# Altium schematic sheet KLogShield.SchDoc
size C
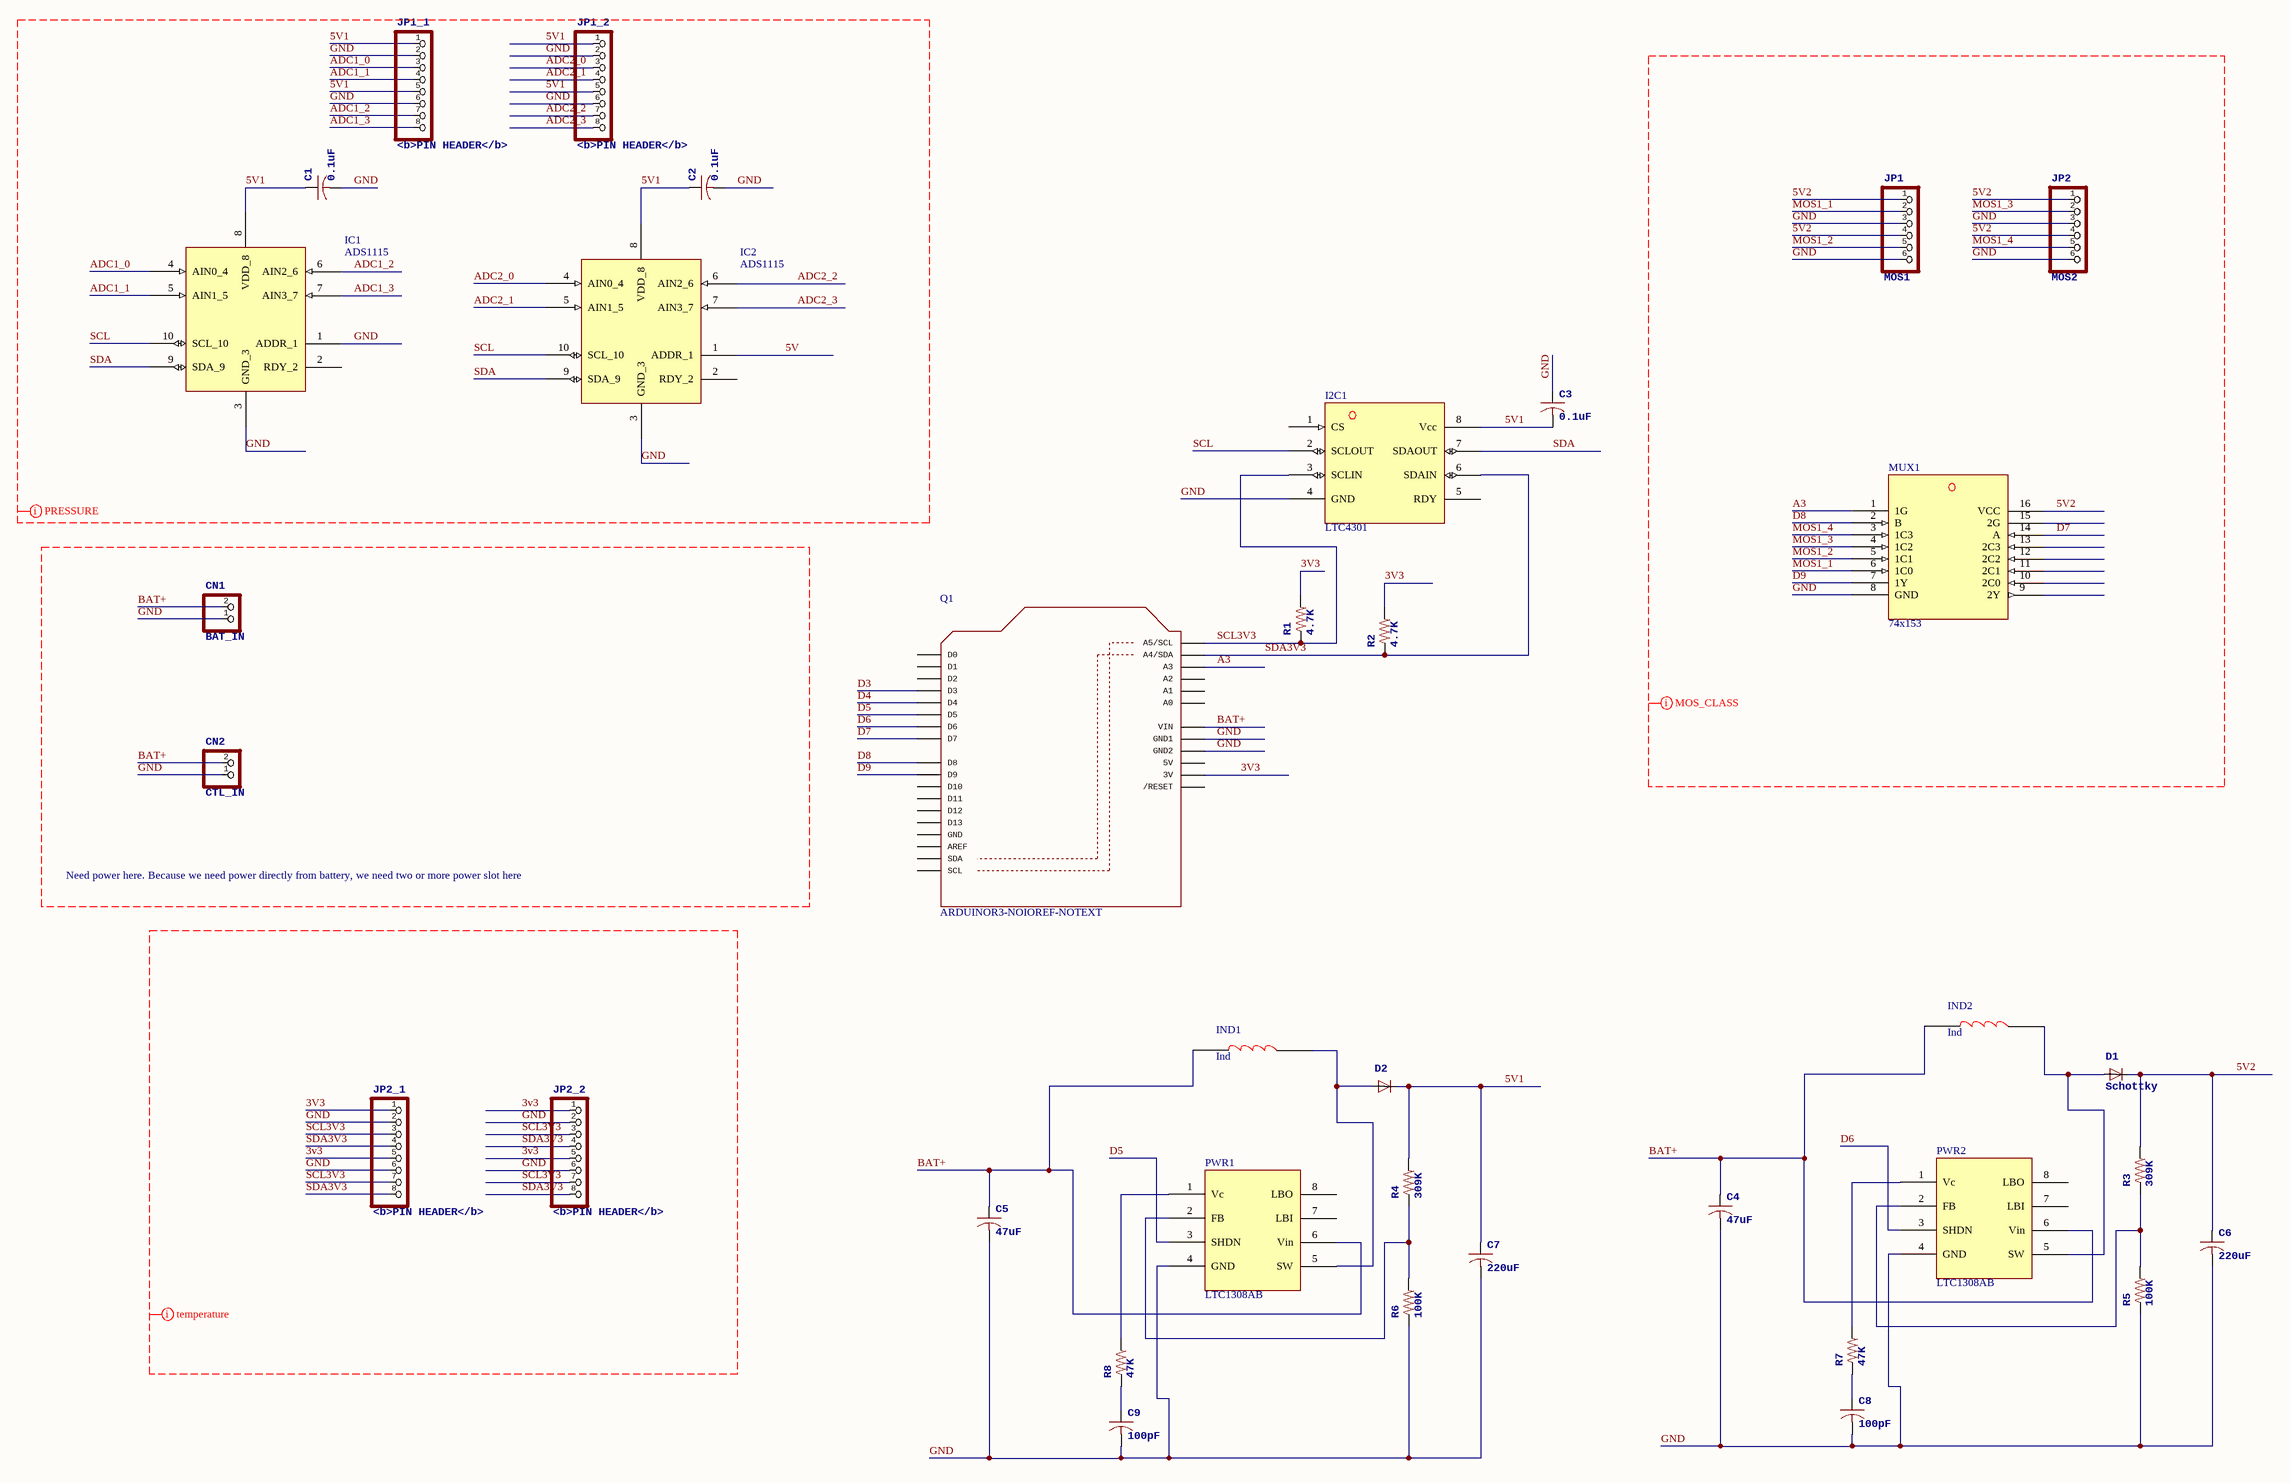
[diagram p0: KLogShield.SchDoc]

## Parts
C1  0.1uF  [C0805]
C2  0.1uF  [C0805]
C3  0.1uF  [C0805]
C4  47uF  [C0805]
C5  47uF  [C0805]
C6  220uF  [C0805]
C7  220uF  [C0805]
C8  100pF  [C0805]
C9  100pF  [C0805]
CN1  BAT_IN  [JST-PH-2-THM]
CN2  CTL_IN  [JST-PH-2-THM]
D1  Schottky  [SOD-123]
D2  Schottky  [SOD-123]  (value not drawn)
I2C1  LTC4301  [TSSOP-8]
IC1  ADS1115  [10-VSSOP]
IC2  ADS1115  [10-VSSOP]
IND1  Ind  [R1005]
IND2  Ind  [R1005]
JP1  MOS1  [1X06]
JP1_1  <b>PIN HEADER</b>  [1X08-BIG]
JP1_2  <b>PIN HEADER</b>  [1X08-BIG]
JP2  MOS2  [1X06]
JP2_1  <b>PIN HEADER</b>  [1X08-BIG]
JP2_2  <b>PIN HEADER</b>  [1X08-BIG]
MUX1  74x153  [SO16]
PWR1  LTC1308AB  [SO08]
PWR2  LTC1308AB  [SO08]
Q1  ARDUINOR3-NOIOREF-NOTEXT  [ARDUINOR3-NOTEXT-NOIOREF]
R1  4.7K  [M0805]
R2  4.7K  [M0805]
R3  309K  [M0805]
R4  309K  [M0805]
R5  100K  [M0805]
R6  100K  [M0805]
R7  47K  [M0805]
R8  47K  [M0805]

## Nets
3V3: JP2_1.1 JP2_1.5 JP2_2.1 JP2_2.5 Q1.3V R1.2 R2.2
5V: IC2.1(ADDR_1)
5V1: C1.1 C2.1 C3.2 C7.1 D2.C I2C1.8(Vcc) IC1.8(VDD_8) IC2.8(VDD_8) JP1_1.1 JP1_1.5 JP1_2.1 JP1_2.5 R4.2
5V2: C6.1 D1.C JP1.1 JP1.4 JP2.1 JP2.4 MUX1.16(VCC) R3.2
A3: MUX1.1(1G) Q1.A3
ADC1_0: IC1.4(AIN0_4) JP1_1.3
ADC1_1: IC1.5(AIN1_5) JP1_1.4
ADC1_2: IC1.6(AIN2_6) JP1_1.7
ADC1_3: IC1.7(AIN3_7) JP1_1.8
ADC2_0: IC2.4(AIN0_4) JP1_2.3
ADC2_1: IC2.5(AIN1_5) JP1_2.4
ADC2_2: IC2.6(AIN2_6) JP1_2.7
ADC2_3: IC2.7(AIN3_7) JP1_2.8
BAT+: C4.1 C5.1 CN1.2 CN2.2 IND1.1 IND2.1 PWR1.6(Vin) PWR2.6(Vin) Q1.VIN
D3: Q1.D3
D4: Q1.D4
D5: PWR1.3(SHDN) Q1.D5
D6: PWR2.3(SHDN) Q1.D6
D7: MUX1.14(A) Q1.D7
D8: MUX1.2(B) Q1.D8
D9: MUX1.7(1Y) Q1.D9
GND: C1.2 C2.2 C3.1 C4.2 C5.2 C6.2 C7.2 C8.2 C9.2 CN1.1 CN2.1 I2C1.4(GND) IC1.1(ADDR_1) IC1.3(GND_3) IC2.3(GND_3) JP1.3 JP1.6 JP1_1.2 JP1_1.6 JP1_2.2 JP1_2.6 JP2.3 JP2.6 JP2_1.2 JP2_1.6 JP2_2.2 JP2_2.6 MUX1.8(GND) PWR1.4(GND) PWR2.4(GND) Q1.GND1 Q1.GND2 R5.1 R6.1
MOS1_1: JP1.2 MUX1.6(1C0)
MOS1_2: JP1.5 MUX1.5(1C1)
MOS1_3: JP2.2 MUX1.4(1C2)
MOS1_4: JP2.5 MUX1.3(1C3)
SCL: I2C1.2(SCLOUT) IC1.10(SCL_10) IC2.10(SCL_10)
SCL3V3: I2C1.3(SCLIN) JP2_1.3 JP2_1.7 JP2_2.3 JP2_2.7 Q1.A5(A5/SCL) R1.1
SDA: I2C1.7(SDAOUT) IC1.9(SDA_9) IC2.9(SDA_9)
SDA3V3: I2C1.6(SDAIN) JP2_1.4 JP2_1.8 JP2_2.4 JP2_2.8 Q1.A4(A4/SDA) R2.1
NetC8_1: C8.1 R7.1
NetC9_1: C9.1 R8.1
NetD1_A: D1.A IND2.2 PWR2.5(SW)
NetD2_A: D2.A IND1.2 PWR1.5(SW)
NetPWR1_1: PWR1.1(Vc) R8.2
NetPWR1_2: PWR1.2(FB) R4.1 R6.2
NetPWR2_1: PWR2.1(Vc) R7.2
NetPWR2_2: PWR2.2(FB) R3.1 R5.2

Not connected (* = marked no-connect by the designer): I2C1 1(CS) 5(RDY); IC1 2(RDY_2); IC2 2(RDY_2); MUX1 9(2Y) 10(2C0) 11(2C1) 12(2C2) 13(2C3) 15(2G); PWR1 7(LBI) 8(LBO); PWR2 7(LBI) 8(LBO); Q1 5V A0 A1 A2 AREF D0 D1 D2 D10 D11 D12 D13 GND RESET(/RESET) SCL SDA

## Layout directives
net class pressure: 5V, 5V1, ADC1_0, ADC1_1, ADC1_2, ADC1_3, ADC2_0, ADC2_1, ADC2_2, ADC2_3, GND, SCL, SDA
net class temperature: 3V3, 3v3, GND, SCL3V3, SDA3V3
net class Undefined: 5V2, A3, D7, D8, D9, GND, MOS1_1, MOS1_2, MOS1_3, MOS1_4

## Notes on the sheet
- Need power here. Because we need power directly from battery, we need two or more power slot here

## Library data of the parts
C1-C9 = C-USC0805
CN1 CN2 = JST_2PIN-THM
D1 D2 = DIODESOD-123
IC1 IC2 = ADS1115: vendor: TI
JP1 JP2 = PINHD-1X6
JP1_1 JP1_2 JP2_1 JP2_2 = PINHD-1X8BIG
R1-R8 = R-US_M0805